# EAGLE design L298N_module (EAGLE 9.5.2)
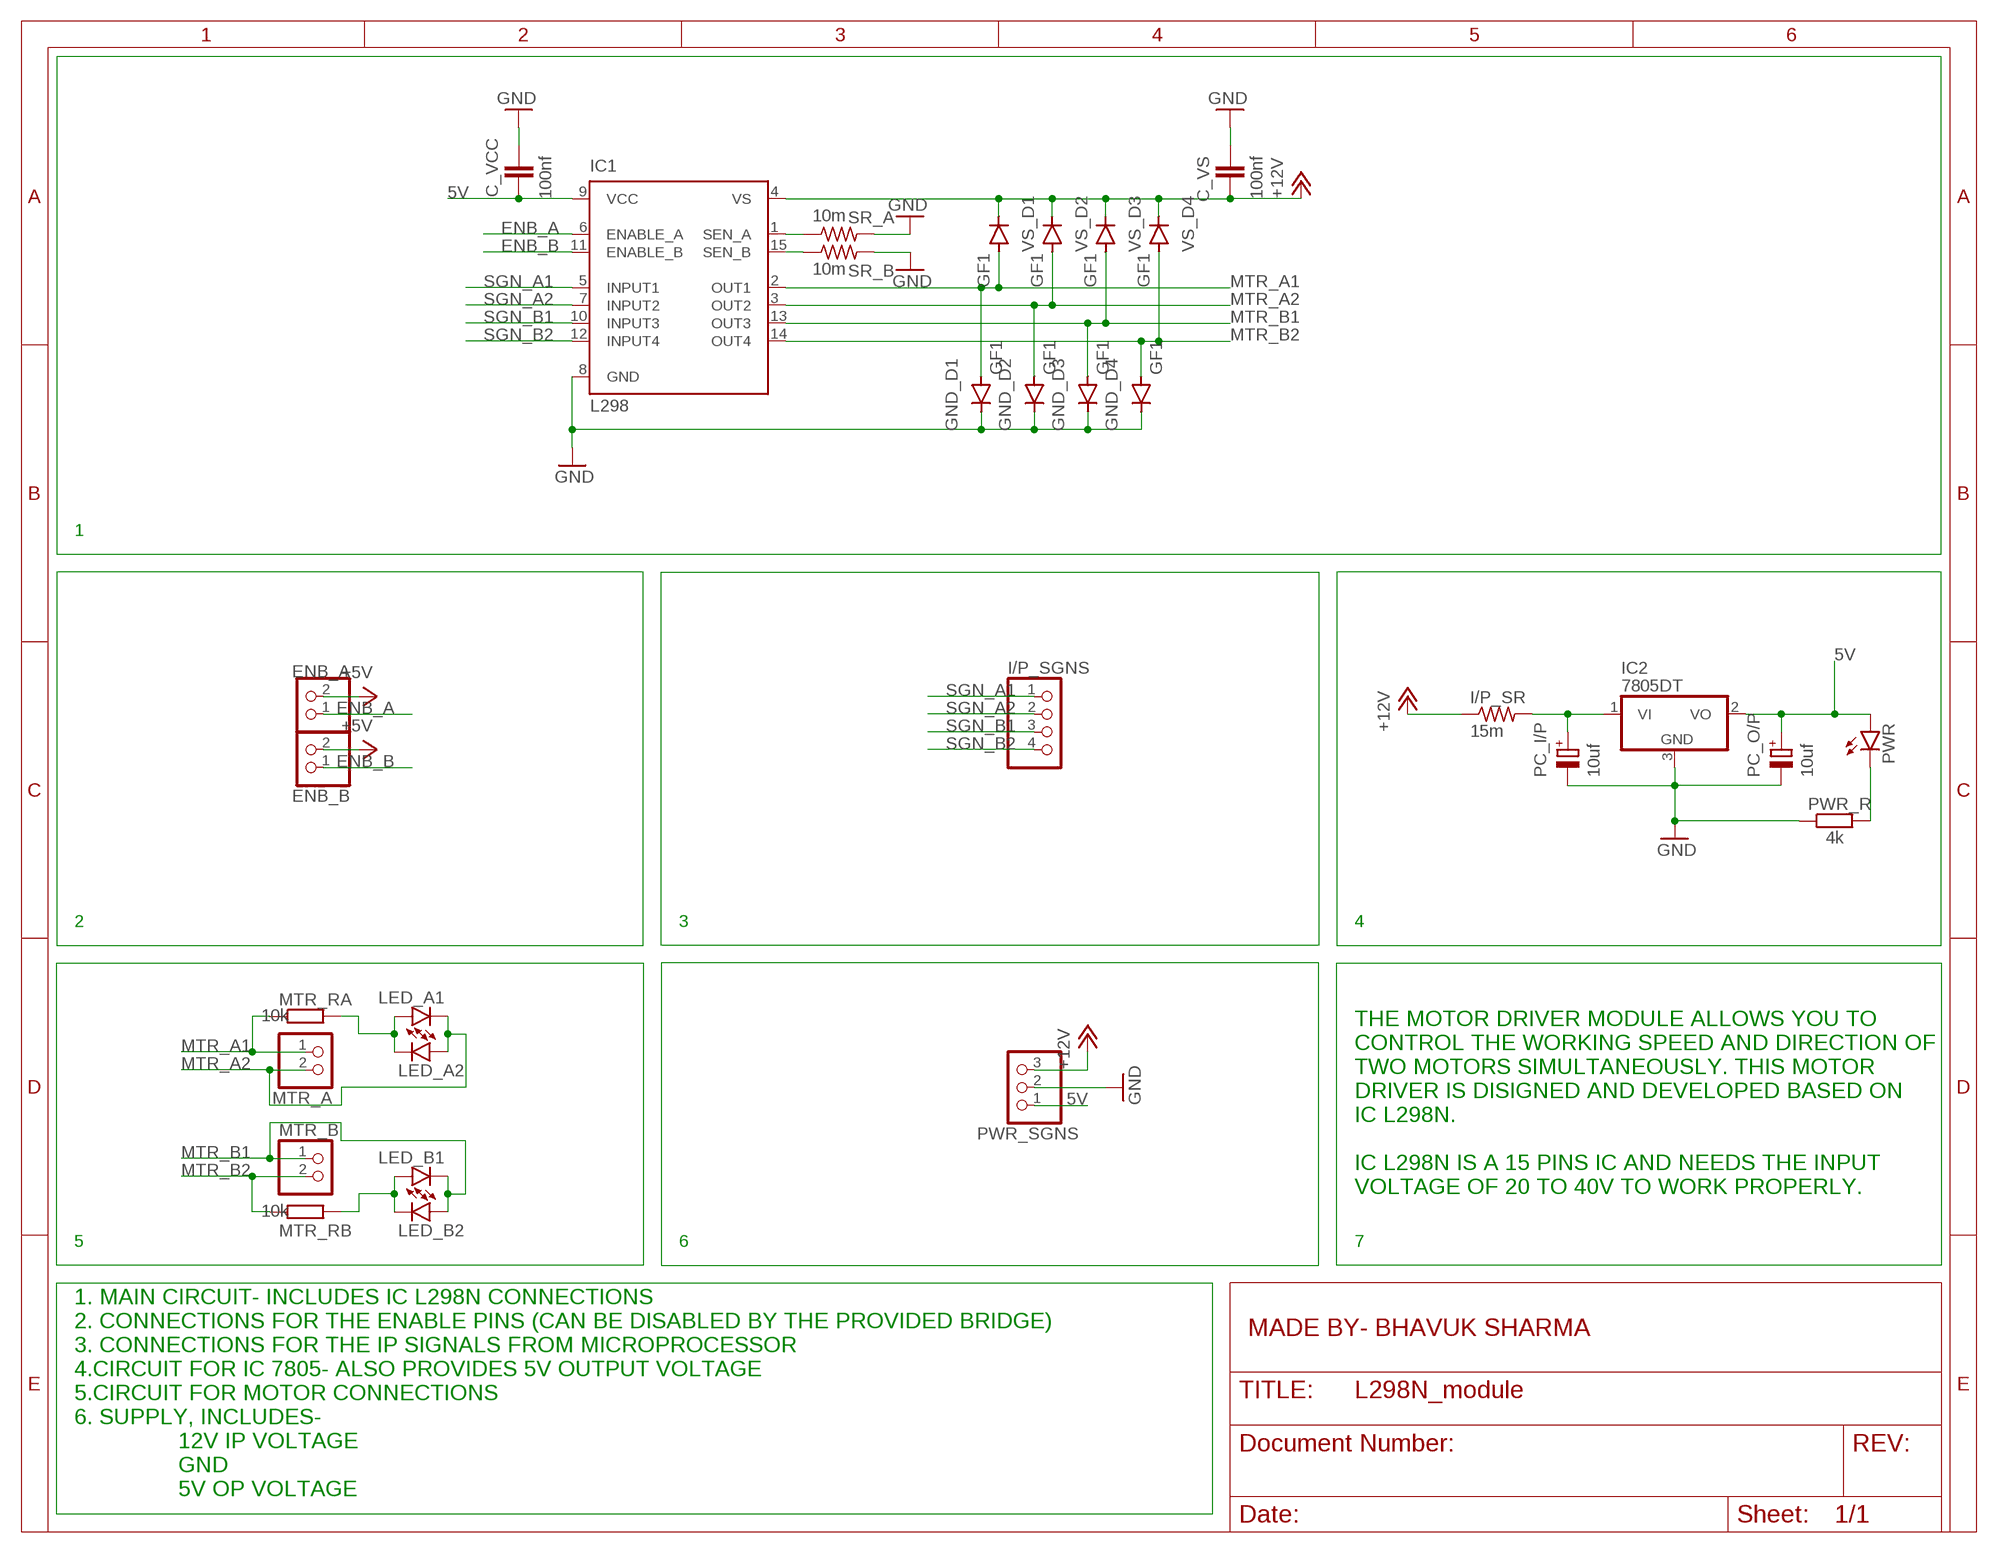
[diagram p0: schematic, sheet 1]

## Parts
C_VCC  100nf  C-EU025-025X050  [C025-025X050]
C_VS  100nf  C-EU025-025X050  [C025-025X050]
ENB_A  PINHD-1X2  [1X02]
ENB_B  PINHD-1X2  [1X02]
GND_D1  GF1  [SMA-DO214AC]
GND_D2  GF1  [SMA-DO214AC]
GND_D3  GF1  [SMA-DO214AC]
GND_D4  GF1  [SMA-DO214AC]
I/P_SGNS  PINHD-1X4  [1X04]
I/P_SR  15m  R-US_0204/7  [0204/7]
IC1  L298  [MULTIWATT-15]
IC2  7805DT  [TO252]
LED_A1  LEDCHIP-LED0805  [CHIP-LED0805]
LED_A2  LEDCHIP-LED0805  [CHIP-LED0805]
LED_B1  LEDCHIP-LED0805  [CHIP-LED0805]
LED_B2  LEDCHIP-LED0805  [CHIP-LED0805]
MTR_A  PINHD-1X2  [1X02]
MTR_B  PINHD-1X2  [1X02]
MTR_RA  10k  R-EU_0204/7  [0204/7]
MTR_RB  10k  R-EU_0204/7  [0204/7]
PC_I/P  10uf  CPOL-EU139CLL-2R  [139CLL-2R]
PC_O/P  10uf  CPOL-EU139CLL-2R  [139CLL-2R]
PWR  LED5MM  [LED5MM]
PWR_R  4k  R-EU_0204/7  [0204/7]
PWR_SGNS  PINHD-1X3  [1X03]
SR_A  10m  R-US_0204/7  [0204/7]
SR_B  10m  R-US_0204/7  [0204/7]
VS_D1  GF1  [SMA-DO214AC]
VS_D2  GF1  [SMA-DO214AC]
VS_D3  GF1  [SMA-DO214AC]
VS_D4  GF1  [SMA-DO214AC]

## Nets
5V: C_VCC.1 IC1.9(VCC) IC2.2(VO) PC_O/P.+ PWR.A PWR_SGNS.1
+5V: ENB_A.2 ENB_B.2
+12V: C_VS.1 I/P_SR.1 IC1.4(VS) PWR_SGNS.3 VS_D1.K(C) VS_D2.K(C) VS_D3.K(C) VS_D4.K(C)
ENB_A: ENB_A.1 IC1.6(ENABLE_A)
ENB_B: ENB_B.1 IC1.11(ENABLE_B)
GND: C_VCC.2 C_VS.2 GND_D1.K(C) GND_D2.K(C) GND_D3.K(C) GND_D4.K(C) IC1.8(GND) IC2.3(GND) PC_I/P.- PC_O/P.- PWR_R.1 PWR_SGNS.2 SR_A.2 SR_B.2
MTR_A1: GND_D1.A IC1.2(OUT1) MTR_A.1 MTR_RA.1 VS_D1.A
MTR_A2: GND_D2.A IC1.3(OUT2) LED_A1.C LED_A2.A MTR_A.2 VS_D2.A
MTR_B1: GND_D3.A IC1.13(OUT3) LED_B1.C LED_B2.A MTR_B.1 VS_D3.A
MTR_B2: GND_D4.A IC1.14(OUT4) MTR_B.2 MTR_RB.1 VS_D4.A
N$1: LED_A1.A LED_A2.C MTR_RA.2
N$5: PWR.K(C) PWR_R.2
N$6: IC1.1(SEN_A) SR_A.1
N$7: I/P_SR.2 IC2.1(VI) PC_I/P.+
N$10: IC1.15(SEN_B) SR_B.1
N$14: LED_B1.A LED_B2.C MTR_RB.2
SGN_A1: I/P_SGNS.1 IC1.5(INPUT1)
SGN_A2: I/P_SGNS.2 IC1.7(INPUT2)
SGN_B1: I/P_SGNS.3 IC1.10(INPUT3)
SGN_B2: I/P_SGNS.4 IC1.12(INPUT4)

## Notes on the sheet
- 1
- 2 | 3 | 4
- THE MOTOR DRIVER MODULE ALLOWS YOU TO
  CONTROL THE WORKING SPEED AND DIRECTION OF
  TWO MOTORS SIMULTANEOUSLY. THIS MOTOR 
  DRIVER IS DISIGNED AND DEVELOPED BASED ON 
  IC L298N.
  
  IC L298N IS A 15 PINS IC AND NEEDS THE INPUT 
  VOLTAGE OF 20 TO 40V TO WORK PROPERLY.
- 5 | 6 | 7
- MADE BY- BHAVUK SHARMA
- 1. MAIN CIRCUIT- INCLUDES IC L298N CONNECTIONS
  2. CONNECTIONS FOR THE ENABLE PINS (CAN BE DISABLED BY THE PROVIDED BRIDGE)
  3. CONNECTIONS FOR THE IP SIGNALS FROM MICROPROCESSOR
  4.CIRCUIT FOR IC 7805- ALSO PROVIDES 5V OUTPUT VOLTAGE
  5.CIRCUIT FOR MOTOR CONNECTIONS
  6. SUPPLY, INCLUDES-
                  12V IP VOLTAGE
                  GND
                  5V OP VOLTAGE

## Library data of the parts
C_VCC C_VS = rcl:C-EU: CAPACITOR, European symbol; SPICEPREFIX: C
ENB_A ENB_B MTR_A MTR_B = pinhead:PINHD-1X2: PIN HEADER; SPICEPREFIX: B
GND_D1-GND_D4 VS_D1-VS_D4 = diode:GF1: DIODE; SPICEPREFIX: B
I/P_SGNS = pinhead:PINHD-1X4: PIN HEADER; SPICEPREFIX: E
I/P_SR SR_A SR_B = rcl:R-US_: RESISTOR, American symbol; SPICEPREFIX: R
IC1 = st-microelectronics:L298: DUAL FULL-BRIDGE DRIVER; MPN: L298N; OC_FARNELL: 1589425; OC_NEWARK: 32M1527; SPICEPREFIX: X
IC2 = linear:78*: Positive VOLTAGE REGULATOR Source: http://cache.national.com/ds/LM/LM78L05.pdf http://www.fairchildsemi.com/ds/LM/LM7805.pdf; SPICEPREFIX: J
LED_A1 LED_A2 LED_B1 LED_B2 = led:LED: LED OSRAM: - CHIPLED LG R971, LG N971, LY N971, LG Q971, LY Q971, LO R971, LY R971 LH N974, LH R974 LS Q976, LO Q976, LY Q976 LO Q996 - Hyper CHIPLED LW Q18S LB Q993, LB Q99A, LB R99A - SideLED LS A670, LO A670, LY A670, LG A670, LP A670 LB A673, LV A673, LT A673, LW A673 LH A674 LY A675 LS A676, LA A676, LO A676, LY A676, LW A676 LS A679, LY A679, LG A679 - Hyper Micro SIDELED® LS Y876, LA Y876, LO Y876, LY Y876 LT Y87S - SmartLED LW L88C, LW L88S LB L89C, LB L89S, LG L890 LS L89K, LO L89K, LY L89K LS L896, LA L896, LO L896, LY L896 - TOPLED LS T670, LO T670, LY T670, LG T670, LP T670 LSG T670, LSP T670, LSY T670, LOP T670, LYG T670 LG T671, LOG T671, LSG T671 LB T673, LV T673, LT T673, LW T673 LH T674 LS T676, LA T676, LO T676, LY T676, LB T676, LH T676, LSB T676, LW T676 LB T67C, LV T67C, LT T67C, LS T67K, LO T67K, LY T67K, LW E67C LS E67B, LA E67B, LO E67B, LY E67B, LB E67C, LV E67C, LT E67C LW T67C LS T679, LY T679, LG T679 LS T770, LO T770, LY T770, LG T770, LP T770 LB T773, LV T773, LT T773, LW T773 LH T774 LS E675, LA E675, LY E675, LS T675 LS T776, LA T776, LO T776, LY T776, LB T776 LHGB T686 LT T68C, LB T68C - Hyper Mini TOPLED® LB M676 - Mini TOPLED Santana® LG M470 LS M47K, LO M47K, LY M47K Source: http://www.osram.convergy.de LUXEON: - LUMILED® LXK2-PW12-R00, LXK2-PW12-S00, LXK2-PW14-U00, LXK2-PW14-V00 LXK2-PM12-R00, LXK2-PM12-S00, LXK2-PM14-U00 LXK2-PE12-Q00, LXK2-PE12-R00, LXK2-PE12-S00, LXK2-PE14-T00, LXK2-PE14-U00 LXK2-PB12-K00, LXK2-PB12-L00, LXK2-PB12-M00, LXK2-PB14-N00, LXK2-PB14-P00, LXK2-PB14-Q00 LXK2-PR12-L00, LXK2-PR12-M00, LXK2-PR14-Q00, LXK2-PR14-R00 LXK2-PD12-Q00, LXK2-PD12-R00, LXK2-PD12-S00 LXK2-PH12-R00, LXK2-PH12-S00 LXK2-PL12-P00, LXK2-PL12-Q00, LXK2-PL12-R00 Source: www.luxeon.com KINGBRIGHT: KA-3528ASYC Source: www.kingbright.com; SPICEPREFIX: L
MTR_RA MTR_RB PWR_R = rcl:R-EU_: RESISTOR, European symbol; SPICEPREFIX: R
PC_I/P PC_O/P = rcl:CPOL-EU: POLARIZED CAPACITOR, European symbol; SPICEPREFIX: C
PWR = led:LED: LED OSRAM: - CHIPLED LG R971, LG N971, LY N971, LG Q971, LY Q971, LO R971, LY R971 LH N974, LH R974 LS Q976, LO Q976, LY Q976 LO Q996 - Hyper CHIPLED LW Q18S LB Q993, LB Q99A, LB R99A - SideLED LS A670, LO A670, LY A670, LG A670, LP A670 LB A673, LV A673, LT A673, LW A673 LH A674 LY A675 LS A676, LA A676, LO A676, LY A676, LW A676 LS A679, LY A679, LG A679 - Hyper Micro SIDELED® LS Y876, LA Y876, LO Y876, LY Y876 LT Y87S - SmartLED LW L88C, LW L88S LB L89C, LB L89S, LG L890 LS L89K, LO L89K, LY L89K LS L896, LA L896, LO L896, LY L896 - TOPLED LS T670, LO T670, LY T670, LG T670, LP T670 LSG T670, LSP T670, LSY T670, LOP T670, LYG T670 LG T671, LOG T671, LSG T671 LB T673, LV T673, LT T673, LW T673 LH T674 LS T676, LA T676, LO T676, LY T676, LB T676, LH T676, LSB T676, LW T676 LB T67C, LV T67C, LT T67C, LS T67K, LO T67K, LY T67K, LW E67C LS E67B, LA E67B, LO E67B, LY E67B, LB E67C, LV E67C, LT E67C LW T67C LS T679, LY T679, LG T679 LS T770, LO T770, LY T770, LG T770, LP T770 LB T773, LV T773, LT T773, LW T773 LH T774 LS E675, LA E675, LY E675, LS T675 LS T776, LA T776, LO T776, LY T776, LB T776 LHGB T686 LT T68C, LB T68C - Hyper Mini TOPLED® LB M676 - Mini TOPLED Santana® LG M470 LS M47K, LO M47K, LY M47K Source: http://www.osram.convergy.de LUXEON: - LUMILED® LXK2-PW12-R00, LXK2-PW12-S00, LXK2-PW14-U00, LXK2-PW14-V00 LXK2-PM12-R00, LXK2-PM12-S00, LXK2-PM14-U00 LXK2-PE12-Q00, LXK2-PE12-R00, LXK2-PE12-S00, LXK2-PE14-T00, LXK2-PE14-U00 LXK2-PB12-K00, LXK2-PB12-L00, LXK2-PB12-M00, LXK2-PB14-N00, LXK2-PB14-P00, LXK2-PB14-Q00 LXK2-PR12-L00, LXK2-PR12-M00, LXK2-PR14-Q00, LXK2-PR14-R00 LXK2-PD12-Q00, LXK2-PD12-R00, LXK2-PD12-S00 LXK2-PH12-R00, LXK2-PH12-S00 LXK2-PL12-P00, LXK2-PL12-Q00, LXK2-PL12-R00 Source: www.luxeon.com KINGBRIGHT: KA-3528ASYC Source: www.kingbright.com; SPICEPREFIX: B
PWR_SGNS = pinhead:PINHD-1X3: PIN HEADER; SPICEPREFIX: J

## Board
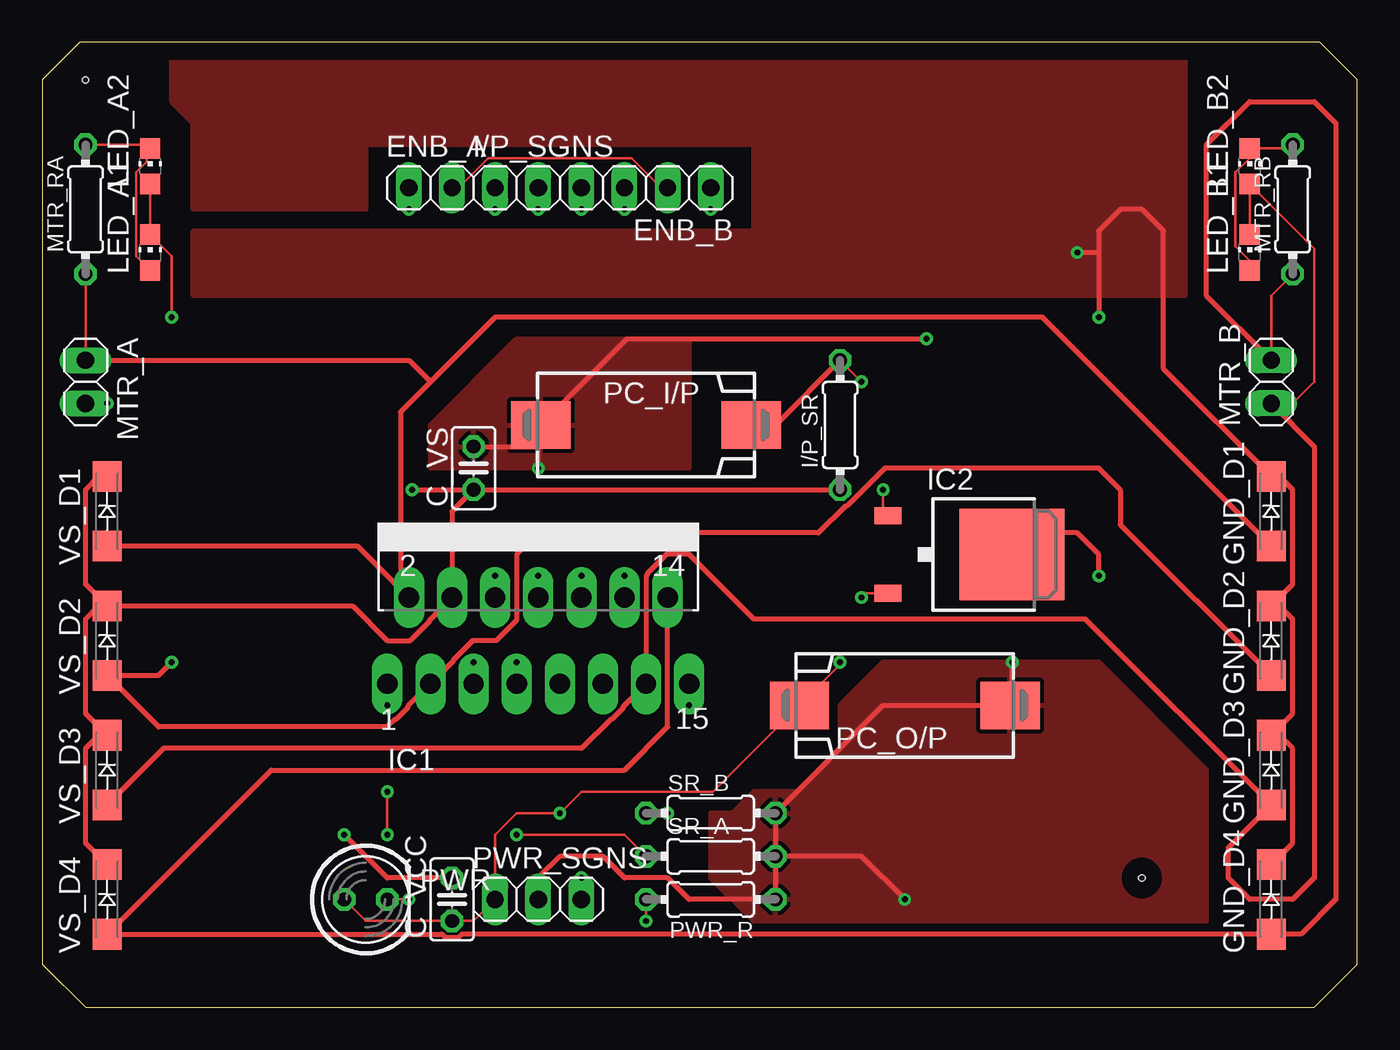
[diagram p1: board, top side]
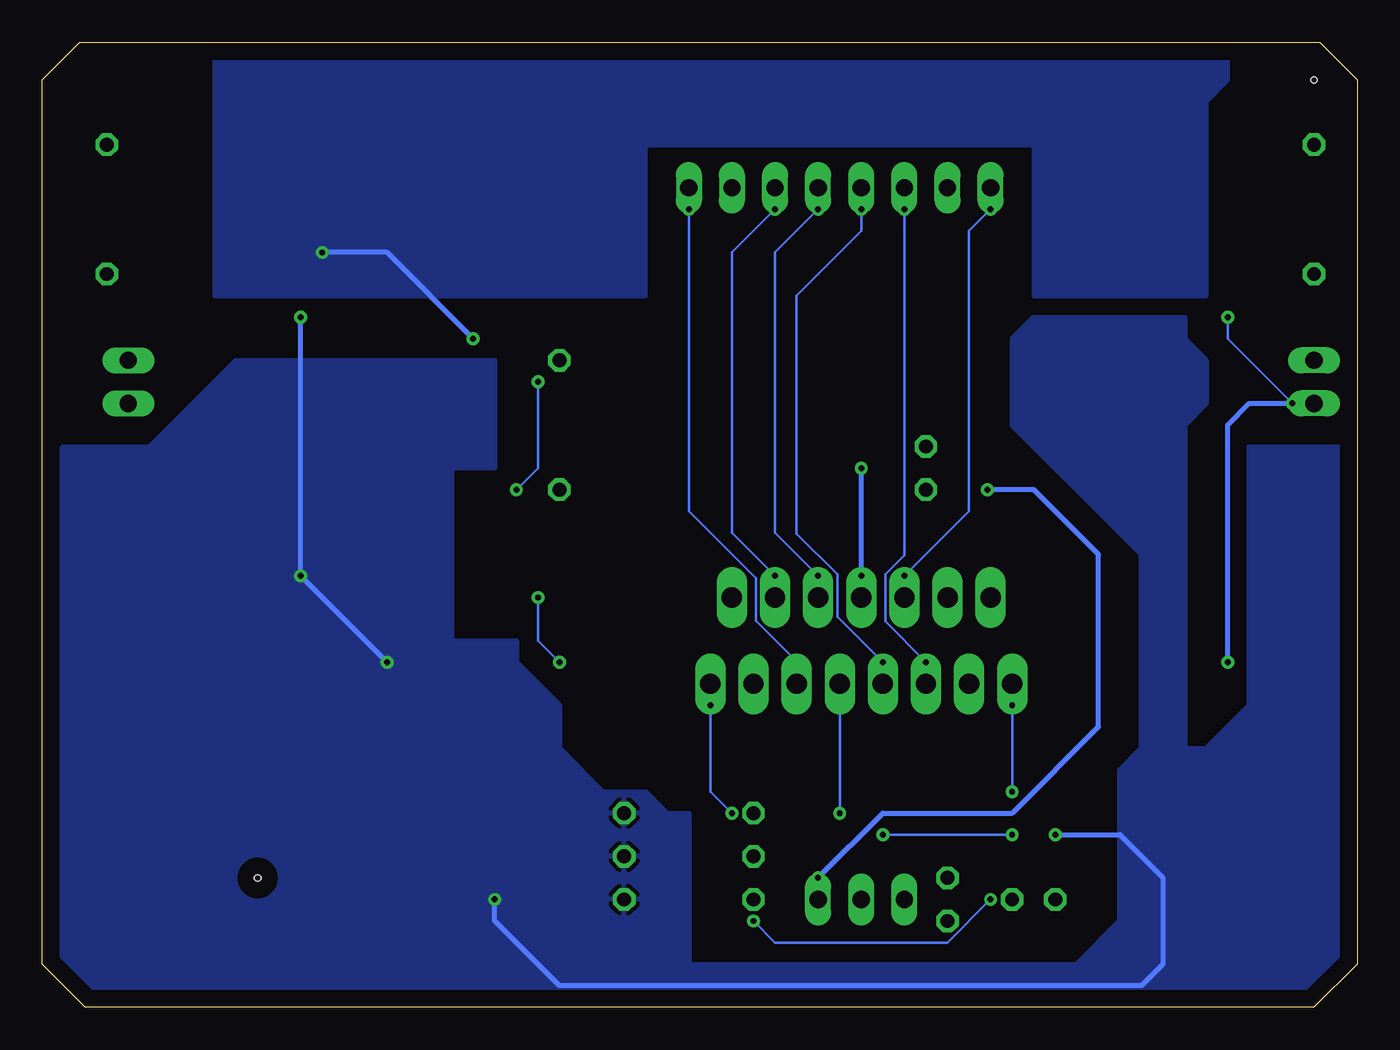
[diagram p2: board, bottom side, seen from below]

Size 77.45 x 56.82 mm. Coordinates in mm from the lower left corner, seen from the top.
Outline: 0,54.61 0,2.54 2.54,0 74.93,0 77.45,2.52 77.45,54.63 75.26,56.82 2.21,56.82 0,54.61
Copper layers (1*16): Top 0.035mm / dielectric 1.5mm / Bottom 0.035mm
Design rules "default": minimum track width 6mil, minimum drill 0.35mm, track to track 6mil, track to pad 6mil, pad to pad 6mil, via to via 6mil, smd to smd 6mil, copper to edge 40mil, drill to drill 6mil, minimum pad ring 10mil, minimum via ring 8mil, stop-mask expansion 4mil, vias tented up to drill 0mil, thermal gap 10mil
Holes 0.35 mm at 2.54,54.61 64.77,7.62

### Footprints (pad centres in the part's own frame; a part is rotated, then mirrored left to right if it is on the bottom)
C025-025X050 = drill 0.813 octagon: 1 -1.27,0; 2 1.27,0
1X02 = drill 1.016 long: 1 -1.27,0; 2 1.27,0
SMA-DO214AC = smd 1.8 x 1.7: A -2.05,0; K 2.05,0
1X04 = drill 1.016 long: 1 -3.81,0; 2 -1.27,0; 3 1.27,0; 4 3.81,0
0204/7 = drill 0.813 octagon: 1 -3.81,0; 2 3.81,0
MULTIWATT-15 = drill 1.2 long: 1 -8.89,-7.62; 2 -7.62,-2.54; 3 -6.35,-7.62; 4 -5.08,-2.54; 5 -3.81,-7.62; 6 -2.54,-2.54; 7 -1.27,-7.62; 8 0,-2.54; 9 1.27,-7.62; 10 2.54,-2.54; 11 3.81,-7.62; 12 5.08,-2.54; 13 6.35,-7.62; 14 7.62,-2.54; 15 8.89,-7.62
TO252 = smd 1 x 1.6: 1 -2.28,-4.8; 2 2.28,-4.8 | smd 5.4 x 6.2: 3 0,2.5
CHIP-LED0805 = smd 1.2 x 1.2: A 0,-1.05; C 0,1.05
139CLL-2R = smd 3.5 x 2.8: + 6.2,0; - -6.2,0
LED5MM = drill 0.813 octagon: A -1.27,0; K 1.27,0
1X03 = drill 1.016 long: 1 -2.54,0; 2 0,0; 3 2.54,0

### Placement (x,y rotation side)
C_VCC  24.13,6.35 90 top
C_VS  25.4,31.75 90 top
ENB_A  22.86,48.26 0 top
ENB_B  38.1,48.26 180 top
GND_D1  72.39,29.21 90 top
GND_D2  72.39,21.59 90 top
GND_D3  72.39,13.97 90 top
GND_D4  72.39,6.35 90 top
I/P_SGNS  30.48,48.26 0 top
I/P_SR  46.99,34.29 90 top
IC1  29.21,26.67 0 top
IC2  54.61,26.67 270 top
LED_A1  6.35,44.45 0 top
LED_A2  6.35,49.53 0 top
LED_B1  71.12,44.45 0 top
LED_B2  71.12,49.53 0 top
MTR_A  2.54,36.83 270 top
MTR_B  72.39,36.83 90 top
MTR_RA  2.54,46.99 90 top
MTR_RB  73.66,46.99 90 top
PC_I/P  35.56,34.29 0 top
PC_O/P  50.8,17.78 180 top
PWR  19.05,6.35 0 top
PWR_R  39.37,6.35 180 top
PWR_SGNS  29.21,6.35 0 top
SR_A  39.37,8.89 0 top
SR_B  39.37,11.43 0 top
VS_D1  3.81,29.21 90 top
VS_D2  3.81,21.59 90 top
VS_D3  3.81,13.97 90 top
VS_D4  3.81,6.35 90 top

### Tracks (layer width: path | path; a pad name or v marks a point on that pad's centre or on a via)
5V  (via drill 0.35)
  Top 0.152: PWR.A 19.05,5.08 C_VCC.1 25.4,5.08 PWR_SGNS.1 26.67,10.16 27.94,11.43 v30.48,11.43 31.75,12.7 39.52,12.7 PC_O/P.+ 46.99,20.17 v46.99,20.32 | v48.26,24.13 48.52,24.39 IC2.2
  Bottom 0.152: v30.48,11.43 IC1.9 | v46.99,20.32 48.26,21.59 v48.26,24.13
+5V
  Top 0.152: ENB_A.2 24.51,48.26 26.26,50.01 34.7,50.01 36.45,48.26 ENB_B.2
+12V  (via drill 0.35)
  Top 0.305: VS_D4.K 2.54,9.67 2.54,15.24 3.32,16.02 VS_D3.K 2.54,17.29 2.54,22.86 3.32,23.64 VS_D2.K | VS_D2.K 2.54,24.91 2.54,30.48 3.32,31.26 VS_D1.K | VS_D2.K 18.27,23.64 20.32,21.59 21.65,21.59 22.8,22.73 22.8,22.8 IC1.4 24.13,29.21 C_VS.1 | PWR_SGNS.3 v31.75,7.62 | v21.78,30.48 C_VS.1 | C_VS.1 I/P_SR.1
  Bottom 0.305: v31.75,7.62 27.94,11.43 20.32,11.43 15.24,16.51 15.24,26.67 19.05,30.48 v21.78,30.48
ENB_A  (via drill 0.35)
  Top 0.152: ENB_A.1 v21.59,46.99 | v26.67,25.4 IC1.6
  Bottom 0.152: v21.59,46.99 22.86,45.72 22.86,29.21 v26.67,25.4
ENB_B  (via drill 0.35)
  Top 0.152: ENB_B.1 v39.37,46.99
  Bottom 0.152: v39.37,46.99 39.37,29.21 35.42,25.26 35.42,22.76 33.02,20.36 IC1.11
GND  (via drill 0.35)
  Top 0.305: GND_D4.K 73.66,9.67 73.66,15.24 72.88,16.02 GND_D3.K 73.66,17.29 73.66,22.86 72.88,23.64 GND_D2.K 73.66,24.91 73.66,30.48 72.88,31.26 GND_D1.K 66.04,37.61 66.04,45.72 64.77,46.99 63.5,46.99 62.23,45.72 62.23,44.45 | SR_A.2 SR_B.2 49.53,17.78 57.15,17.78 57.15,17.93 | SR_A.2 PWR_R.1 38.1,6.35 36.83,7.62 34.29,7.62 33.02,8.89 30.48,8.89 29.21,7.62 PWR_SGNS.2 | IC1.8 v29.21,25.4 | v29.21,31.75 29.21,33.02 | 29.21,33.02 29.21,34.14 PC_I/P.- 34.44,39.37 v52.07,39.37 | C_VS.2 29.21,33.02 | PC_O/P.- 57.15,17.93 | 57.15,17.93 v57.15,20.32 | v62.23,25.4 62.23,26.67 60.96,27.94 57.15,27.94 57.11,27.9 IC2.3 | 62.23,44.45 v62.23,40.64 | C_VCC.2 20.32,7.62 v17.78,10.16 | v50.8,6.35 48.26,8.89 SR_A.2 | v60.96,44.45 62.23,44.45
  Bottom 0.305: v29.21,25.4 v29.21,31.75 | v57.15,20.32 v62.23,25.4 v62.23,40.64 | v50.8,6.35 50.8,5.08 46.99,1.27 12.7,1.27 11.43,2.54 11.43,7.62 13.97,10.16 v17.78,10.16 | v52.07,39.37 57.15,44.45 v60.96,44.45
  pour Top: 39.37,11.43 39.37,7.62 41.91,5.08 68.58,5.08 68.58,13.97 62.23,20.32 49.53,20.32 46.99,17.78 46.99,15.24 44.45,12.7 43.18,12.7 41.91,12.7 40.64,11.43
  pour Top: 22.86,34.29 27.94,39.37 38.1,39.37 38.1,31.75 22.86,31.75
  pour Top: 7.62,55.88 67.31,55.88 67.31,41.91 8.89,41.91 8.89,45.72 41.91,45.72 41.91,50.8 20.32,50.8 19.05,50.8 19.05,46.99 8.89,46.99 8.89,52.07 7.62,53.34
  pour Bottom: 7.62,55.88 67.31,55.88 67.31,41.91 41.91,41.91 41.91,50.8 19.05,50.8 19.05,41.91 8.89,41.91 8.89,53.34 7.62,54.61
  pour Bottom: 3.81,33.02 0,33.02 0,2.54 2.54,0 50.8,0 74.93,0 77.47,2.54 77.47,3.81 77.47,31.75 76.2,33.02 71.12,33.02 66.04,38.1 50.8,38.1 50.8,31.75 53.34,31.75 53.34,21.59 49.53,21.59 49.53,20.32 46.99,17.78 46.99,15.24 44.45,12.7 41.91,12.7 40.64,11.43 39.37,11.43 39.37,2.54 16.51,2.54 13.97,5.08 13.97,13.97 12.7,15.24 12.7,26.67 20.32,34.29 20.32,39.37 19.05,40.64 10.16,40.64 10.16,39.37 8.89,38.1 8.89,35.56 10.16,34.29 10.16,15.24 8.89,15.24 6.35,17.78 6.35,29.21 6.35,33.02
MTR_A1
  Top 0.152: MTR_RA.1 MTR_A.1
  Top 0.305: VS_D1.A 18.56,27.16 21.1,24.62 | IC1.2 21.1,24.62 | GND_D1.A 58.91,40.64 26.67,40.64 22.86,36.83 | 22.86,36.83 21.1,35.07 21.1,24.62 | 22.86,36.83 21.59,38.1 MTR_A.1
MTR_A2  (via drill 0.35)
  Top 0.152: LED_A2.A LED_A1.C 7.62,44.23 v7.62,40.64 | v3.81,35.56 MTR_A.2
  Top 0.305: v7.62,20.32 6.84,19.54 VS_D2.A 6.84,16.51 20.32,16.51 20.75,16.95 20.82,16.95 21.52,17.65 21.52,17.71 IC1.3 24.2,20.39 24.2,20.45 25.34,21.59 26.73,21.59 27.94,22.8 27.94,26.67 29.21,27.94 45.72,27.94 47.3,29.52 47.39,29.52 49.62,31.75 62.23,31.75 63.5,30.48 63.5,28.43 GND_D2.A
  Bottom 0.152: v7.62,40.64 7.62,39.37 v3.81,35.56
  Bottom 0.305: v7.62,20.32 7.62,34.29 6.35,35.56 v3.81,35.56
MTR_B1
  Top 0.152: LED_B1.C LED_B2.A 74.93,44.67 74.93,36.83 73.66,35.56 MTR_B.1
  Top 0.305: VS_D3.A 7.13,15.24 31.75,15.24 33.45,16.95 33.52,16.95 34.23,17.65 34.23,17.71 IC1.13 35.56,25.4 35.62,25.46 35.62,25.53 36.77,26.67 38.1,26.67 41.91,22.86 61.45,22.86 GND_D3.A 69.85,9.38 69.85,7.62 71.12,6.35 73.66,6.35 74.93,7.62 74.93,33.02 MTR_B.1
MTR_B2
  Top 0.152: MTR_RB.1 72.39,41.91 MTR_B.2
  Top 0.305: IC1.14 36.83,16.51 34.29,13.97 13.48,13.97 VS_D4.A 23.55,4.3 23.73,4.12 24.53,4.12 24.71,4.3 GND_D4.A 74.15,4.3 76.2,6.35 76.2,52.07 74.93,53.34 71.12,53.34 68.58,50.8 68.58,41.91 MTR_B.2
N$1
  Top 0.152: MTR_RA.2 6.13,50.8 | 6.13,50.8 LED_A2.C | 6.13,50.8 6.13,49.78 5.52,49.17 5.52,44.23 5.83,43.92 LED_A1.A
N$5  (via drill 0.35)
  Top 0.152: PWR.K v21.59,6.35 | v35.56,5.08 PWR_R.2
  Bottom 0.152: v21.59,6.35 24.13,3.81 34.29,3.81 v35.56,5.08
N$6  (via drill 0.35)
  Top 0.152: SR_A.1 34.29,10.16 v27.94,10.16 | v20.32,10.16 v20.32,12.7 | v20.32,17.78 IC1.1
  Bottom 0.152: v27.94,10.16 v20.32,10.16 | v20.32,12.7 v20.32,17.78
N$7  (via drill 0.35)
  Top 0.152: IC2.1 49.53,29.23 v49.53,30.48 | v48.26,36.83 I/P_SR.2
  Top 0.305: I/P_SR.2 43.18,34.29 PC_I/P.+
  Bottom 0.152: v49.53,30.48 48.26,31.75 v48.26,36.83
N$10  (via drill 0.35)
  Top 0.152: SR_B.1 v36.83,11.43 | v38.1,17.78 IC1.15
  Bottom 0.152: v36.83,11.43 38.1,12.7 v38.1,17.78
N$14
  Top 0.152: MTR_RB.2 73.44,50.58 LED_B2.C 71.12,50 70.29,49.17 70.29,44.8 71.12,43.98 LED_B1.A
SGN_A1  (via drill 0.35)
  Top 0.152: I/P_SGNS.1 v26.67,46.99 | v25.4,20.32 IC1.5
  Bottom 0.152: v25.4,20.32 27.8,22.72 27.8,25.5 26.67,26.63 v26.67,46.99
SGN_A2  (via drill 0.35)
  Top 0.152: IC1.7 v27.94,20.32 | I/P_SGNS.2 v29.21,46.99
  Bottom 0.152: v27.94,20.32 30.62,23 30.62,25.5 33.02,27.9 33.02,41.91 29.21,45.72 v29.21,46.99
SGN_B1  (via drill 0.35)
  Top 0.152: I/P_SGNS.3 v31.75,46.99 | v31.75,25.4 IC1.10
  Bottom 0.152: v31.75,25.4 34.29,27.94 34.29,44.45 v31.75,46.99
SGN_B2  (via drill 0.35)
  Top 0.152: I/P_SGNS.4 v34.29,46.99 | v34.29,25.4 IC1.12
  Bottom 0.152: v34.29,46.99 36.83,44.45 36.83,27.94 v34.29,25.4